# Altium schematic sheet -NEW-AQB-5-ANTON_TRANS-PWR-GALVO.SchDoc
size B; Organization: AQRONOS; Address1: 12789 Emerson St.; Address2: Thornton, CO  80021; Address3: USA
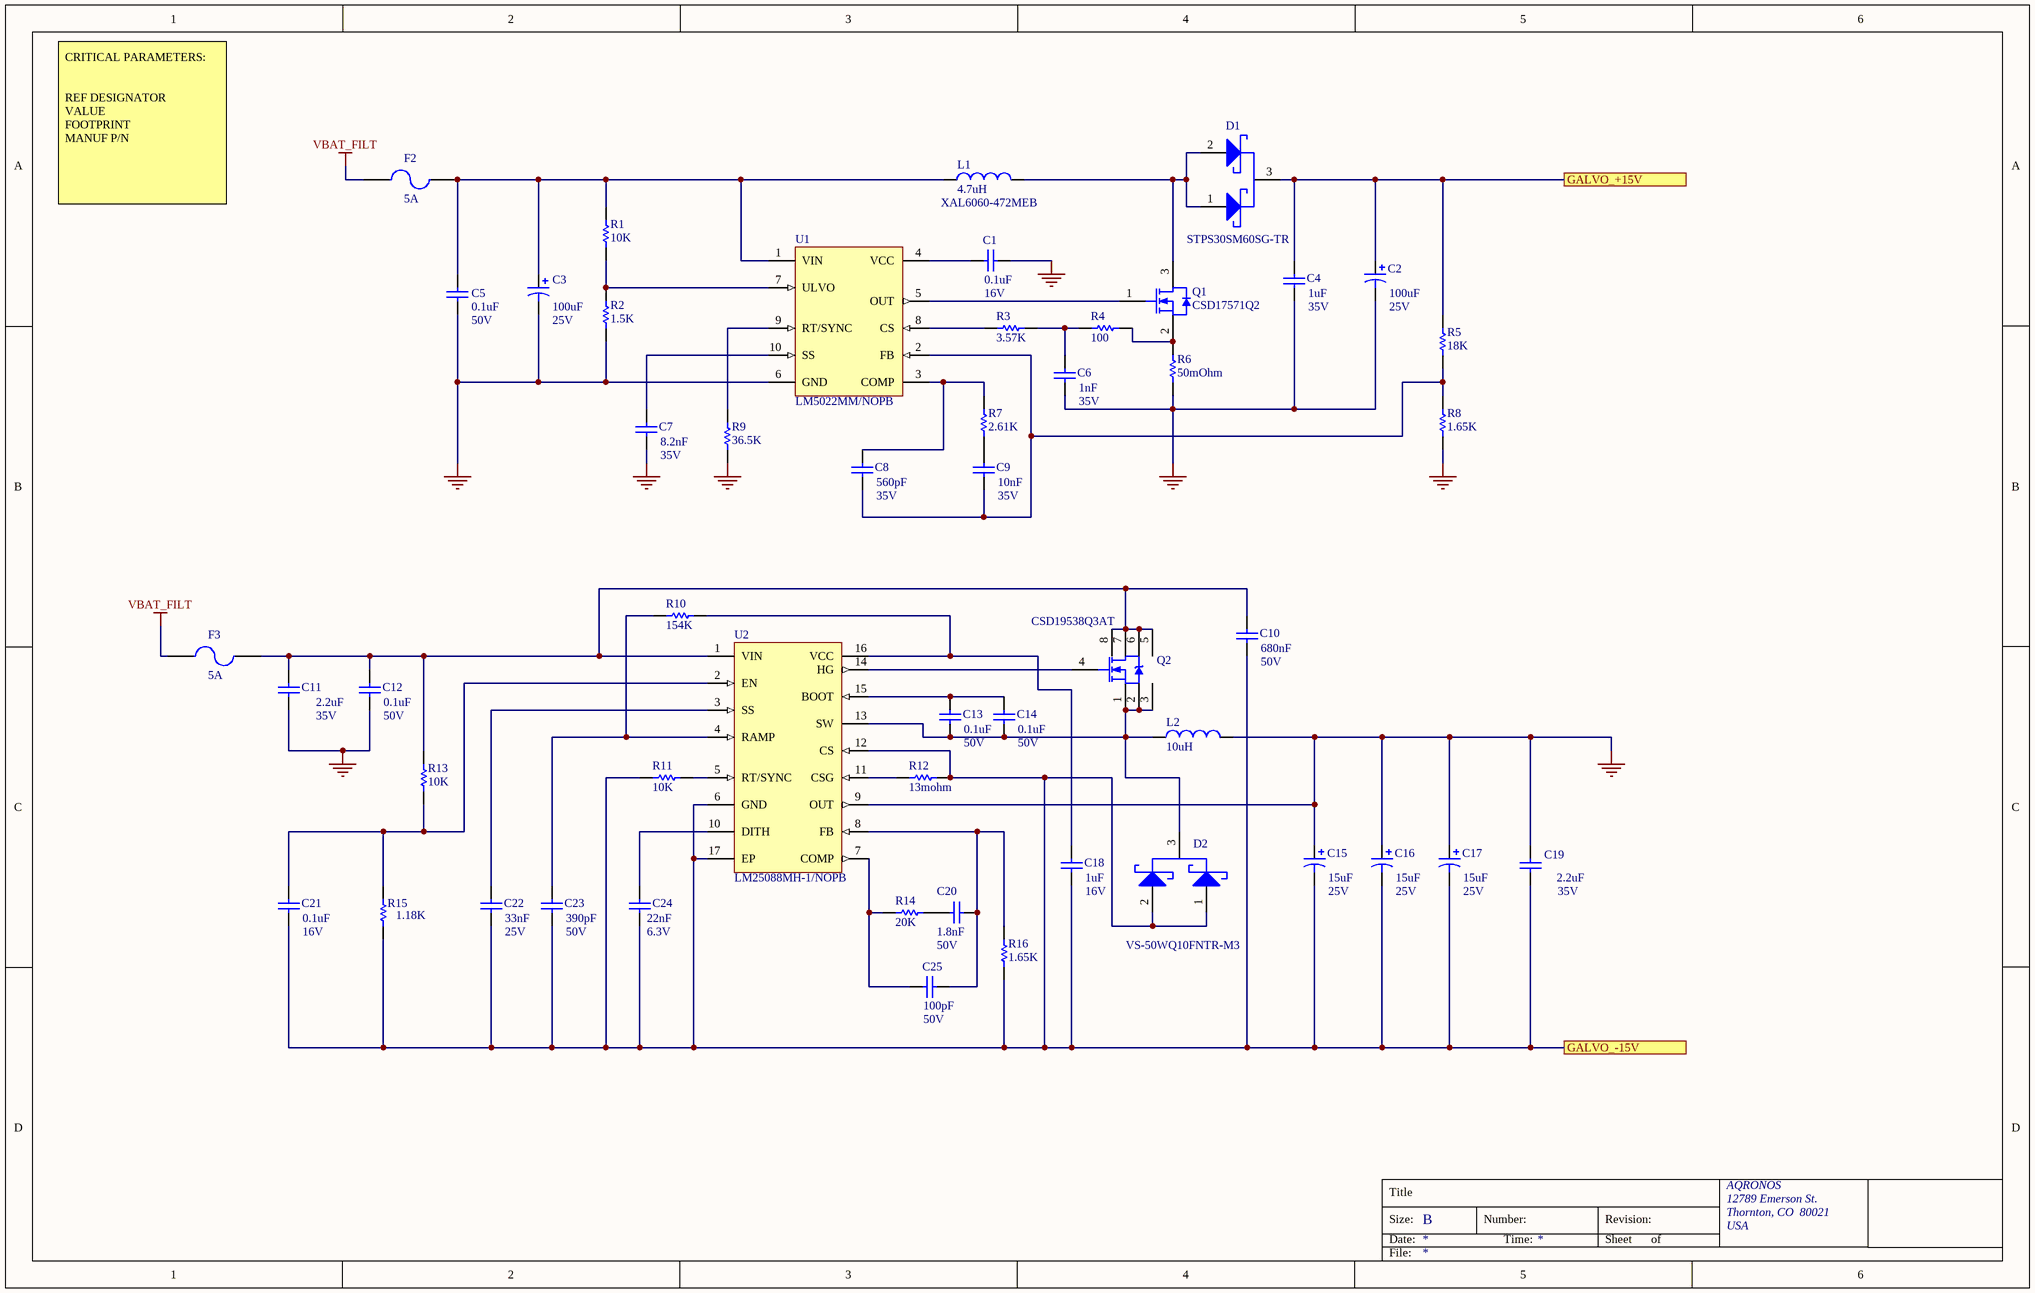
[diagram p0: -NEW-AQB-5-ANTON_TRANS-PWR-GALVO.SchDoc]

## Parts
C1  value 0.1uF  Voltage: 16V  [CAP0402]  (hidden comment: Capacitor_non_pol)
C2  value 100uF  Voltage: 25V  [EEE-FK1H470XP]  (hidden comment: Capacitor-Polarized)
C3  value 100uF  Voltage: 25V  (hidden comment: Capacitor-Polarized)
C4  value 1uF  Voltage: 35V  [CAP0402]  (hidden comment: Capacitor_non_pol)
C5  value 0.1uF  Voltage: 50V  [CAP0402]  (hidden comment: Capacitor_non_pol)
C6  value 1nF  Voltage: 35V  [CAP0402]  (hidden comment: Capacitor_non_pol)
C7  value 8.2nF  Voltage: 35V  [CAP0402]  (hidden comment: Capacitor_non_pol)
C8  value 560pF  Voltage: 35V  [CAP0402]  (hidden comment: Capacitor_non_pol)
C9  value 10nF  Voltage: 35V  [CAP0402]  (hidden comment: Capacitor_non_pol)
C10  value 680nF  Voltage: 50V  [CAP0603]  (hidden comment: Capacitor_non_pol)
C11  value 2.2uF  Voltage: 35V  [CAP0603]  (hidden comment: Capacitor_non_pol)
C12  value 0.1uF  Voltage: 50V  [CAP0805]  (hidden comment: Capacitor_non_pol)
C13  value 0.1uF  Voltage: 50V  [CAP0805]  (hidden comment: Capacitor_non_pol)
C14  value 0.1uF  Voltage: 50V  [CAP0805]  (hidden comment: Capacitor_non_pol)
C15  value 15uF  Voltage: 25V  [EEE-FK1H470XP]  (hidden comment: Capacitor-Polarized)
C16  value 15uF  Voltage: 25V  [EEE-FK1H470XP]  (hidden comment: Capacitor-Polarized)
C17  value 15uF  Voltage: 25V  [EEE-FK1H470XP]  (hidden comment: Capacitor-Polarized)
C18  value 1uF  Voltage: 16V  [CAP0603]  (hidden comment: Capacitor_non_pol)
C19  value 2.2uF  Voltage: 35V  [CAP0603]  (hidden comment: Capacitor_non_pol)
C20  value 1.8nF  Voltage: 50V  [CAP0805]  (hidden comment: Capacitor_non_pol)
C21  value 0.1uF  Voltage: 16V  [CAP0402]  (hidden comment: Capacitor_non_pol)
C22  value 33nF  Voltage: 25V  [CAP0402]  (hidden comment: Capacitor_non_pol)
C23  value 390pF  Voltage: 50V  [CAP0402]  (hidden comment: Capacitor_non_pol)
C24  value 22nF  Voltage: 6.3V  [CAP0402]  (hidden comment: Capacitor_non_pol)
C25  value 100pF  Voltage: 50V  [CAP0805]  (hidden comment: Capacitor_non_pol)
D1  Manufacturer Part Number: STPS30SM60SG-TR  [ONSC-D2PAK-3-418AJ_A_V]  (hidden comment: Schottky-3-Terminal)
D2  VS-50WQ10FNTR-M3  [ONSC-D2PAK-3-418AJ_A_V]
F2  Current: 5A  [RES0603]  (hidden comment: Fuse)
F3  Current: 5A  [RES0603]  (hidden comment: Fuse)
L1  4.7uH  Manufacturer Part Number: XAL6060-472MEB  [PA4320.104NLT]
L2  10uH  [PA4320.104NLT]
Q1  CSD17571Q2  [NXP-SOT23_N]
Q2  CSD19538Q3AT  [CSD18531Q5A-3D]
R1  value 10K  [RES0402]  (hidden comment: Resistor)
R2  value 1.5K  [RES0402]  (hidden comment: Resistor)
R3  value 3.57K  [RES0402]  (hidden comment: Resistor)
R4  value 100  [RES0402]  (hidden comment: Resistor)
R5  value 18K  [RES0603]  (hidden comment: Resistor)
R6  value 50mOhm  [RES1206]  (hidden comment: Resistor)
R7  value 2.61K  [RES0402]  (hidden comment: Resistor)
R8  value 1.65K  [RES0402]  (hidden comment: Resistor)
R9  value 36.5K  [RES0402]  (hidden comment: Resistor)
R10  value 154K  [RES0402]  (hidden comment: Resistor)
R11  value 10K  [RES0402]  (hidden comment: Resistor)
R12  value 13mohm  [RES0402]  (hidden comment: Resistor)
R13  value 10K  [RES0402]  (hidden comment: Resistor)
R14  value 20K  [RES0402]  (hidden comment: Resistor)
R15  value 1.18K  [RES0402]  (hidden comment: Resistor)
R16  value 1.65K  [RES0402]  (hidden comment: Resistor)
U1  LM5022MM/NOPB  [MUB10A_N]
U2  LM25088MH-1/NOPB  [MXA16A_N]

## Ports
GALVO_+15V, GALVO_-15V

## Nets
GND: C1.2 C2.2 C3.2 C4.2 C5.2 C6.2 C7.2 C11.2 C12.1 C15.1 C16.1 C17.1 C19.1 L2.2 R2.2 R6.1 R8.1 R9.2 U1.6(GND) U2.9(OUT)
VBAT_FILT: F2.1 F3.1
GALVO_+15V: C2.1 C4.1 D1.3(K) R5.1 ; port GALVO_+15V
GALVO_-15V: C10.2 C15.2 C16.2 C17.2 C18.2 C19.2 C21.2 C22.2 C23.2 C24.2 D2.1(A) D2.2(A) R11.2 R12.2 R15.1 R16.1 U2.6(GND) U2.12(CS) U2.17(EP) ; port GALVO_-15V
NetC1_1: C1.1 U1.4(VCC)
NetC3_1: C3.1 C5.1 F2.2 L1.1 R1.1 U1.1(VIN)
NetC6_1: C6.1 R3.2 R4.1
NetC7_1: C7.1 U1.10(SS)
NetC8_1: C8.1 C9.1 R5.2 R8.2 U1.2(FB)
NetC8_2: C8.2 R7.2 U1.3(COMP)
NetC9_2: C9.2 R7.1
NetC10_1: C10.1 C11.1 C12.2 F3.2 Q2.5(D) Q2.6(D) Q2.7(D) Q2.8(D) R13.2 U2.1(VIN)
NetC13_1: C13.1 C14.1 D2.3(K) L2.1 Q2.1(S) Q2.2(S) Q2.3(S) U2.13(SW)
NetC13_2: C13.2 C14.2 U2.15(BOOT)
NetC18_1: C18.1 R10.1 U2.16(VCC)
NetC20_1: C20.1 R14.1
NetC20_2: C20.2 C25.2 R16.2 U2.8(FB)
NetC21_1: C21.1 R13.1 R15.2 U2.2(EN)
NetC22_1: C22.1 U2.3(SS)
NetC23_1: C23.1 R10.2 U2.4(RAMP)
NetC24_1: C24.1 U2.10(DITH)
NetC25_1: C25.1 R14.2 U2.7(COMP)
NetD1_1: D1.1(A) D1.2(A) L1.2 Q1.3(D)
NetQ1_1: Q1.1(G) U1.5(OUT)
NetQ1_2: Q1.2(S) R4.2 R6.2
NetQ2_4: Q2.4(G) U2.14(HG)
NetR1_2: R1.2 R2.1 U1.7(ULVO)
NetR3_1: R3.1 U1.8(CS)
NetR9_1: R9.1 U1.9(RT/SYNC)
NetR11_1: R11.1 U2.5(RT/SYNC)
NetR12_1: R12.1 U2.11(CSG)

## Notes on the sheet
- CRITICAL PARAMETERS:
  REF DESIGNATOR
  VALUE
  FOOTPRINT
  MANUF P/N
- Title
- Size:
- Date:
- B
- Number:
- Time:
- Revision:
- Sheet
- of
- File:

## Library data of the parts
C1 C21 = Capacitor_non_pol: CAP CER 0.1UF 16V X7R 0402; Manufacturer Part Number: GRM155R71C104KA88D; Distributor Part Number: 490-3261-1-ND; Footprint: *; P/N: *; Tolerance: *; Vendor: *; Manufacturer: *; Power: *; Current: *; Supplier Part Number 1: 490-3261-1-ND
C2 = Capacitor-Polarized: CAP ALUM POLY 100UF 20% 25V SMD; Manufacturer Part Number: 25SVPF100M; Distributor Part Number: P123675CT-ND; Footprint: *; HelpURL: *; P/N: *; Tolerance: *; Vendor: *; Current: *; Power: *; Manufacturer: *; Supplier Part Number 1: P123675CT-ND
C3 = Capacitor-Polarized: CAP ALUM POLY HYB 100UF 25V SMD; Manufacturer Part Number: EEHZA1E101XP; Distributor Part Number: P15436CT-ND; Footprint: SMT Radial Can; HelpURL: *; P/N: *; Tolerance: *; Vendor: *; Current: *; Power: *; Manufacturer: *; Supplier Part Number 1: P15436CT-ND
C4 = Capacitor_non_pol: CAP CER 1UF 35V X5R 0402; Manufacturer Part Number: C1005X5R1V105K050BC; Distributor Part Number: 445-9073-1-ND; Footprint: *; P/N: *; Tolerance: *; Vendor: *; Manufacturer: *; Power: *; Current: *; Supplier Part Number 1: 445-9073-1-ND; Vendor Part Number: *
C5 = Capacitor_non_pol: CAP CER 0.1UF 50V X5R 0402; Manufacturer Part Number: C1005X5R1H104K050BB; Distributor Part Number: 445-5942-1-ND; Footprint: 0402; P/N: *; Tolerance: *; Vendor: *; Manufacturer: *; Power: *; Current: *; Supplier Part Number 1: 445-5942-1-ND
C6 = Capacitor_non_pol: CAP CER 1000PF 50V C0G/NP0 0402; Manufacturer Part Number: GRM1555C1H102JA01J; Distributor Part Number: 490-6190-1-ND; Footprint: *; P/N: *; Tolerance: *; Vendor: *; Manufacturer: *; Power: *; Current: *; Supplier Part Number 1: 490-6190-1-ND
C7 = Capacitor_non_pol: CAP CER 8200PF 25V X7R 0402; Manufacturer Part Number: GRM155R71E822KA01D; Distributor Part Number: 490-1311-1-ND; Footprint: 0402; P/N: *; Tolerance: *; Vendor: *; Manufacturer: *; Power: *; Current: *; Supplier Part Number 1: 490-1311-1-ND
C8 = Capacitor_non_pol: CAP CER 560PF 50V C0G/NP0 0402; Manufacturer Part Number: GRM1555C1H561JA01J; Distributor Part Number: 490-6248-1-ND; Footprint: *; P/N: *; Tolerance: *; Vendor: *; Manufacturer: *; Power: *; Current: *; Supplier Part Number 1: 490-6248-1-ND
C9 = Capacitor_non_pol: CAP CER 10000PF 35V X7R 0402; Manufacturer Part Number: CGA2B3X7R1V103K050BB; Distributor Part Number: 445-6900-1-ND; Footprint: *; P/N: *; Tolerance: *; Vendor: *; Manufacturer: *; Power: *; Current: *; Supplier Part Number 1: 445-6900-1-ND
C10 = Capacitor_non_pol: CAP CER 0.68UF 50V X5R 0603; Manufacturer Part Number: C1608X5R1H684K080AB; Distributor Part Number: 445-12509-1-ND; Footprint: *; P/N: *; Tolerance: *; Vendor: *; Manufacturer: *; Power: *; Current: *; Supplier Part Number 1: 445-12509-1-ND
C11 C19 = Capacitor_non_pol: CAP CER 2.2UF 35V X5R 0603; Manufacturer Part Number: C1608X5R1V225K080AC; Distributor Part Number: 445-8025-1-ND; Footprint: *; P/N: *; Tolerance: *; Vendor: *; Manufacturer: *; Power: *; Current: *; Supplier Part Number 1: 445-8025-1-ND
C12-C14 = Capacitor_non_pol: CAP CER 0.1UF 50V X7R 0805; Manufacturer Part Number: CC0805KRX7R9BB104; Distributor Part Number: 311-1140-1-ND; Footprint: *; P/N: *; Tolerance: *; Vendor: *; Manufacturer: *; Power: *; Current: *; Supplier Part Number 1: 311-1140-1-ND
C15-C17 = Capacitor-Polarized: CAP ALUM POLY 15UF 20% 25V SMD; Manufacturer Part Number: 25SVPG15M; Distributor Part Number: P18932CT-ND; Footprint: *; HelpURL: *; P/N: *; Tolerance: *; Vendor: *; Current: *; Power: *; Manufacturer: *; Supplier Part Number 1: P18932CT-ND
C18 = Capacitor_non_pol: CAP CER 1UF 16V X7R 0603; Manufacturer Part Number: EMK107B7105KA-T; Distributor Part Number: 587-1241-1-ND; Footprint: *; P/N: *; Tolerance: *; Vendor: *; Manufacturer: *; Power: *; Current: *; Supplier Part Number 1: 587-1241-1-ND
C20 = Capacitor_non_pol: CAP CER 1800PF 50V C0G 0805; Manufacturer Part Number: CGA4C2C0G1H182J060AA; Distributor Part Number: 445-12616-1-ND; Footprint: *; P/N: *; Tolerance: *; Vendor: *; Manufacturer: *; Power: *; Current: *; Supplier Part Number 1: 445-12616-1-ND
C22 = Capacitor_non_pol: CAP CER 0.033UF 25V X7R 0402; Manufacturer Part Number: GRM155R71E333KA88D; Distributor Part Number: 490-3253-1-ND; Footprint: *; P/N: *; Tolerance: *; Vendor: *; Manufacturer: *; Power: *; Current: *; Supplier Part Number 1: 490-3253-1-ND
C23 = Capacitor_non_pol: CAP CER 390PF 50V C0G/NP0 0402; Manufacturer Part Number: GRM1555C1H391JA01J; Distributor Part Number: 490-6236-1-ND; Footprint: *; P/N: *; Tolerance: *; Vendor: *; Manufacturer: *; Power: *; Current: *; Supplier Part Number 1: 490-6236-1-ND
C24 = Capacitor_non_pol: AP CER 0.022UF 6.3V X5R 0402; Manufacturer Part Number: C0402C223K9PACTU; Distributor Part Number: 399-3014-1-ND; Footprint: *; P/N: *; Tolerance: *; Vendor: *; Manufacturer: *; Power: *; Current: *; Supplier Part Number 1: 399-3014-1-ND
C25 = Capacitor_non_pol: CAP CER 100PF 50V C0G/NP0 0805; Manufacturer Part Number: CL21C101JBANNNC; Distributor Part Number: 1276-1014-1-ND; Footprint: *; P/N: *; Tolerance: *; Vendor: *; Manufacturer: *; Power: *; Current: *; Supplier Part Number 1: 1276-1014-1-ND
D1 = Schottky-3-Terminal: DIODE SCHOTTKY 60V 30A D2PAK; Manufacturer: On Semiconductor; PartNumber: SZP6SMB20AT3G; Direction: Unidirectional; IR Max (uA): 5; Packing: Tape and Reel; PPK Max (W): 600; V(BR) Typ (V): 20; DatasheetVersion: Rev. J; PackageVersion: Rev. J, 07/2012; PackageReference: SMB-2-403A-03_J; PackageDescription: 2-Pin Small Molded Package, J-Bend Lead, Body 4.33 x 3.625 mm; Supplier 1: Digi-Key; Supplier Part Number 1: 497-12329-1-ND; Supplier 2: Mouser; Supplier Part Number 2: 497-12329-1-ND; RoHS: Pb-Free; Mounting Technology: Surface Mount; ComponentLink1Description: Manufacturer URL; ComponentLink1URL: http://www.onsemi.com/; ComponentLink2Description: Datasheet; ComponentLink2URL: http://www.onsemi.com/pub_link/Collateral/P6SMB6.8AT3-D.PDF; ComponentLink3Description: Package Specification; ComponentLink3URL: http://www.onsemi.com/pub_link/Collateral/P6SMB6.8AT3-D.PDF; Distributor Part Number: 497-12329-1-ND; Footprint: D2PAK
D2 = Schottky-3-Terminal: Manufacturer: On Semiconductor; Direction: Unidirectional; IR Max (uA): 5; Packing: Tape and Reel; PPK Max (W): 600; V(BR) Typ (V): 20; DatasheetVersion: Rev. J; PackageVersion: Rev. J, 07/2012; PackageReference: SMB-2-403A-03_J; PackageDescription: 2-Pin Small Molded Package, J-Bend Lead, Body 4.33 x 3.625 mm; Supplier 1: Digi-Key; Supplier Part Number 1: VS-50WQ10FNTR-M3CT-ND; Supplier 2: Mouser; Supplier Part Number 2: VS-50WQ10FNTR-M3CT-ND; RoHS: Pb-Free; Mounting Technology: Surface Mount; PartNumber: VS-50WQ10FNTR-M3; ComponentLink1Description: Manufacturer URL; ComponentLink1URL: http://www.onsemi.com/; ComponentLink2Description: Datasheet; ComponentLink2URL: http://www.onsemi.com/pub_link/Collateral/P6SMB6.8AT3-D.PDF; ComponentLink3Description: Package Specification; ComponentLink3URL: http://www.onsemi.com/pub_link/Collateral/P6SMB6.8AT3-D.PDF; Manufacturer Part Number: VS-50WQ10FNTR-M3; Distributor Part Number: VS-50WQ10FNTR-M3CT-ND
F2 F3 = Fuse: FUSE BOARD MNT 5A 32VAC/VDC 0603; Manufacturer Part NUmber: TR/0603FA5-R; Manufacturer: Eaton; Published: 8-Jun-2000; LatestRevisionDate: 17-Jul-2002; LatestRevisionNote: Re-released for DXP Platform.; PackageReference: PIN-W2/E2.8; Publisher: Altium Limited; Vendor: *; Distributor Part Number: 283-2564-1-ND; Voltage: *; Power: *; Tolerance: *; Footprint: 0603
L1 = Inductor: Fixed Inductors 4.7uH 20% 11A 14.40mOhms AEC-Q200; Vendor: MOUSER; Distributor Part Number: 994-XAL6060-472MEB; Footprint: *; HelpURL: *; Manufacturer: *; Tolerance: *; Value: *; Current: 11A; Voltage: *; Power: *
L2 = Inductor: FIXED IND 10UH 5A 21 MOHM SMD; Manufacturer Part Number: SRR1208-100ML; Vendor: DIGIKEY; Distributor Part Number: SRR1208-100MLCT-ND; Footprint: *; HelpURL: *; Manufacturer: *; Tolerance: *; Value: *; Current: 5A; Voltage: *; Power: *
Q1 = BSS138P,215: N-Channel Trench MOSFET, 60 V, 0.36 A, -55 to 150 degC, 3-Pin SOT23, Tape and Reel; Manufacturer: NXP Semiconductors; Automotive Qualified: Y; Channel Type: N; ID [max] (A): 0.36; IDM [max] (A): 1.2; Packing: Tape & Reel; VDS [max] (V): 60; DatasheetVersion: Rev. 1; PackageVersion: 06-03-16, 03/2006; PackageReference: SOT23; PackageDescription: 3-Pin Small Outline Transistor Package, Body 2.9 x 1.3 mm, Pitch 0.95 mm; Supplier 1: Digi-Key; Supplier Part Number 1: 568-10308-2-ND; Supplier 2: Digi-Key; Supplier Part Number 2: 568-10308-1-ND; Supplier 3: Digi-Key; Supplier Part Number 3: 568-10308-6-ND; Supplier 4: Newark; Supplier Part Number 4: 54T9070; Supplier 5: Mouser; Supplier Part Number 5: 771-BSS138P215; VGSth [typ] (V): 1.2; Mounting Technology: Surface Mount; Code_JEDEC: TO-236AB; PartNumber: BSS138P,215; ComponentLink1Description: Manufacturer URL; ComponentLink1URL: http://www.nxp.com/; ComponentLink2Description: Datasheet; ComponentLink2URL: http://www.nxp.com/documents/data_sheet/BSS138P.pdf; ComponentLink3Description: Package Specification; ComponentLink3URL: http://www.nxp.com/documents/outline_drawing/sot023_po.pdf; Manufacturer Part Number: CSD17571Q2; Distributor Part Number: 296-37193-1-ND
Q2 = CSD18531Q5A: MOSFET N-CH 100V 15A VSONP; Published: 8-Jun-2000; LatestRevisionDate: 17-Jul-2002; LatestRevisionNote: Re-released for DXP Platform.; DatasheetVersion: 6-Oct-1997; PackageVersion: Aug-1998; PackageReference: VSONP; Publisher: Altium Limited; PackageDescription: SOT-457/SC-74; 6 Leads; Body 3.1 x 3 mm, inc. leads (LxW max); ComponentLink1Description: Manufacturer Link; ComponentLink1URL: http://www.vishay.com/; ComponentLink2Description: Datasheet; ComponentLink2URL: http://www.vishay.com/docs/70192/70192.pdf; Manufacturer Part Number: CSD19538Q3A; Supplier Part Number: 296-44473-1-ND; Distributor Part Number: 296-44473-1-ND
R1 = Resistor: RES SMD 10K OHM 0.5% 1/16W 0402; Manufacturer Part Number: ERA-2AED103X; Distributor Part Number: P10KDECT-ND; Footprint: 0402; HelpURL: *; P/N: *; Tolerance: *; Vendor: *; Voltage: *; Power: *; Current: *; Manufacturer: *; Supplier Part Number 1: P10KDECT-ND
R2 = Resistor: RES SMD 1.5K OHM 1% 1/5W 0402; Manufacturer Part Number: CRCW04021K50FKED; Distributor Part Number: 541-1.50KYCT-ND; Footprint: 0402; HelpURL: *; P/N: *; Tolerance: *; Vendor: *; Voltage: *; Power: *; Current: *; Manufacturer: *; Supplier Part Number 1: 541-1.50KYCT-ND
R3 = Resistor: RES SMD 3.57K OHM 1% 1/16W 0402; Manufacturer Part Number: CRCW04023K57FKED; Distributor Part Number: 541-3.57KLCT-ND; Footprint: *; HelpURL: *; P/N: *; Tolerance: *; Vendor: *; Voltage: *; Power: *; Current: *; Manufacturer: *; Supplier Part Number 1: 541-3.57KLCT-ND
R4 = Resistor: RES SMD 100 OHM 1% 1/16W 0402; Manufacturer Part Number: CRCW0402100RFKED; Distributor Part Number: 541-100LCT-ND; Footprint: *; HelpURL: *; P/N: *; Tolerance: *; Vendor: *; Voltage: *; Power: *; Current: *; Manufacturer: *; Supplier Part Number 1: 541-100LCT-ND
R5 = Resistor: RES SMD 18K OHM 1% 1/10W 0603; Manufacturer Part Number: RC0603FR-0718KL; Distributor Part Number: 311-18.0KHRCT-ND; Footprint: *; HelpURL: *; P/N: *; Vendor: *; Voltage: *; Power: *; Current: *; Manufacturer: *; Supplier Part Number 1: 311-18.0KHRCT-ND
R6 = Resistor: RES 0.05 OHM 1% 1/2W 1206; Manufacturer Part Number: CSR1206FK50L0; Distributor Part Number: CSR1206FK50L0CT-ND; Footprint: *; HelpURL: *; P/N: *; Tolerance: *; Vendor: *; Voltage: *; Power: *; Current: *; Manufacturer: *; Supplier Part Number 1: CSR1206FK50L0CT-ND
R7 = Resistor: RES SMD 2.61K OHM 1% 1/16W 0402; Manufacturer Part Number: CRCW04022K61FKED; Distributor Part Number: 541-2.61KLCT-ND; Footprint: *; HelpURL: *; P/N: *; Tolerance: *; Vendor: *; Voltage: *; Power: *; Current: *; Manufacturer: *; Supplier Part Number 1: 541-2.61KLCT-ND
R8 R16 = Resistor: RES SMD 1.65K OHM 1% 1/16W 0402; Manufacturer Part Number: RCW04021K65FKED; Distributor Part Number: 541-1.65KLCT-ND; Footprint: *; HelpURL: *; P/N: *; Tolerance: *; Vendor: *; Voltage: *; Power: *; Current: *; Manufacturer: *; Supplier Part Number 1: 541-1.65KLCT-ND
R9 = Resistor: RES SMD 36.5KOHM 0.1% 1/16W 0402; Manufacturer Part Number: ERA-2AEB3652X; Distributor Part Number: P36.5KDCCT-ND; Footprint: 0402; HelpURL: *; P/N: *; Tolerance: *; Vendor: *; Voltage: *; Power: *; Current: *; Manufacturer: *; Supplier Part Number 1: P36.5KDCCT-ND
R10 = Resistor: Manufacturer Part Number: CRCW0402154KFKED; Distributor Part Number: 541-154KLCT-ND; Footprint: *; HelpURL: *; P/N: *; Tolerance: *; Vendor: *; Voltage: *; Power: *; Current: *; Manufacturer: *
R11 R13 = Resistor: Manufacturer Part Number: RC0201FR-0710KL; Distributor Part Number: 311-10.0KMCT-ND; Footprint: *; HelpURL: *; P/N: *; Tolerance: *; Vendor: *; Voltage: *; Power: *; Current: *; Manufacturer: *
R12 = Resistor: Manufacturer Part Number: PRL1632-R013-F-T1; Distributor Part Number: PRL1632.013FCT-ND; Footprint: *; HelpURL: *; P/N: *; Tolerance: *; Vendor: *; Voltage: *; Power: *; Current: *; Manufacturer: *
R14 = Resistor: RES SMD 1.65K OHM 1% 1/16W 0402; Manufacturer Part Number: CRCW040220K0FKED; Distributor Part Number: 541-1.65KLCT-ND; Footprint: *; HelpURL: *; P/N: *; Tolerance: *; Vendor: *; Voltage: *; Power: *; Current: *; Manufacturer: *; Supplier Part Number 1: 541-1.65KLCT-ND
R15 = Resistor: Manufacturer Part Number: CRCW04021K18FKED; Distributor Part Number: 541-1.18KLCT-ND; Footprint: *; HelpURL: *; P/N: *; Tolerance: *; Vendor: *; Voltage: *; Power: *; Current: *; Manufacturer: *
U1 = LM5022MM/NOPB: 60V Low Side Controller for Boost and SEPIC, 10-pin MSOP, Pb-Free; Manufacturer: National Semiconductor; PackageTopMarking: ZXTT*5022; PowerWise: Y; CompType: Switcher; DatasheetVersion: Oct-2009; PackageVersion: revB, Jul-2003; PackageReference: MUB10A; PackageDescription: Mini-SO, Molded, .118 x .118 x .034in Body, 10 Lead, .0197in Pitch; Manufacturer Part Number: LM5022MM/NOPB; RoHS: Y; PinCount: 10; High-Reliability: Y; Code_JEDEC: MO-187-BA; ComponentLink1Description: Manufacturer URL; ComponentLink1URL: http://www.national.com/; ComponentLink2Description: LM5022 Datasheet; ComponentLink2URL: http://www.national.com/ds/LM/LM5022.pdf; ComponentLink3Description: LM5022 Web Page; ComponentLink3URL: http://www.national.com/pf/LM/LM5022.html; ComponentLink4Description: MUB10A Package Page; ComponentLink4URL: http://www.national.com/packaging/folders/mub10a.html; Distributor Part Number: LM5022MM/NOPBCT-ND
U2 = LM25088MH-1/NOPB: Wide Input Range Non-Synchronous Buck Controller, 16-pin TSSOP-EP, Pb-Free; Manufacturer: National Semiconductor; PackageTopMarking: NSUZXYTT*L25088*MH-1; PowerWise: Y; CompType: MiscPower; DatasheetVersion: Mar-2011; PackageVersion: revA, Apr-2003; PackageReference: MXA16A; PackageDescription: Molded TSSOP, Jedec, Exposed Pad, 5.0 x 4.4 x 0.9mm Body,16 Lead, 0.65mm Pitch; Manufacturer Part Number: LM25088MH-1/NOPB; RoHS: Y; PinCount: 16; High-Reliability: Y; Code_JEDEC: MO-153-ABT; ComponentLink1Description: Manufacturer URL; ComponentLink1URL: http://www.national.com/; ComponentLink2Description: LM25088 Datasheet; ComponentLink2URL: http://www.national.com/ds/LM/LM25088.pdf; ComponentLink3Description: LM25088 Web Page; ComponentLink3URL: http://www.national.com/pf/LM/LM25088.html; ComponentLink4Description: MXA16A Package Page; ComponentLink4URL: http://www.national.com/packaging/folders/mxa16a.html; Distributor Part Number: LM25088MH-1/NOPB-ND